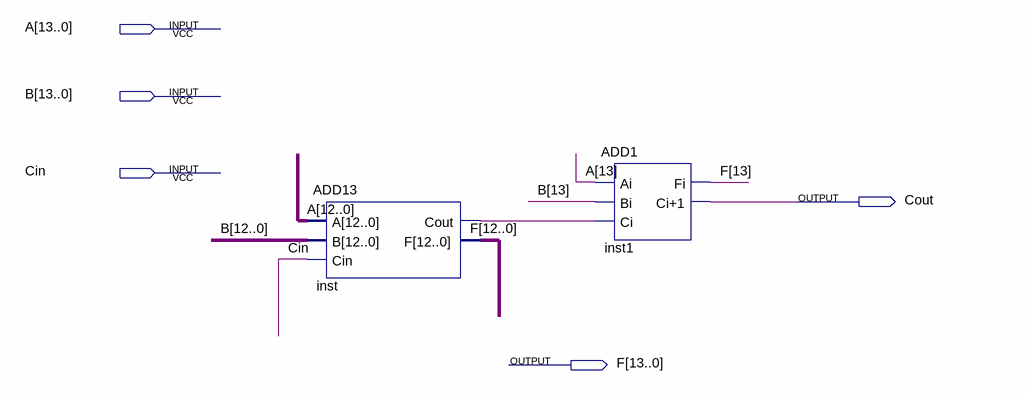
[diagram p0: schematic sheet]
// Quartus schematic ADD14.bdf as structural Verilog: 2 symbols, 5 pins
module ADD14 (
  input  [13:0] A,
  input  [13:0] B,
  input  Cin,
  output Cout,
  output [13:0] F
);

  wire inst_cout;

  ADD13 inst (.A(A[12:0]), .B(B[12:0]), .Cin(Cin), .Cout(inst_cout), .F(F[12:0]));
  ADD1 inst1 (.Ai(A[13]), .Bi(B[13]), .Ci(inst_cout), .Fi(F[13]), .\Ci+1 (Cout));
endmodule
